# Altium schematic sheet 2-SOM Interface.SchDoc: SOM Interface
size B; CompanyName: NextGen RF Design; Address1: 2130 Howard Drive W; Address2: North Mankato, MN 56003; Address3: www.nextgenrf.com; Revision: 2; SheetNumber: 2; SheetTotal: 7; ProjName: BytePipe X9002_HDK
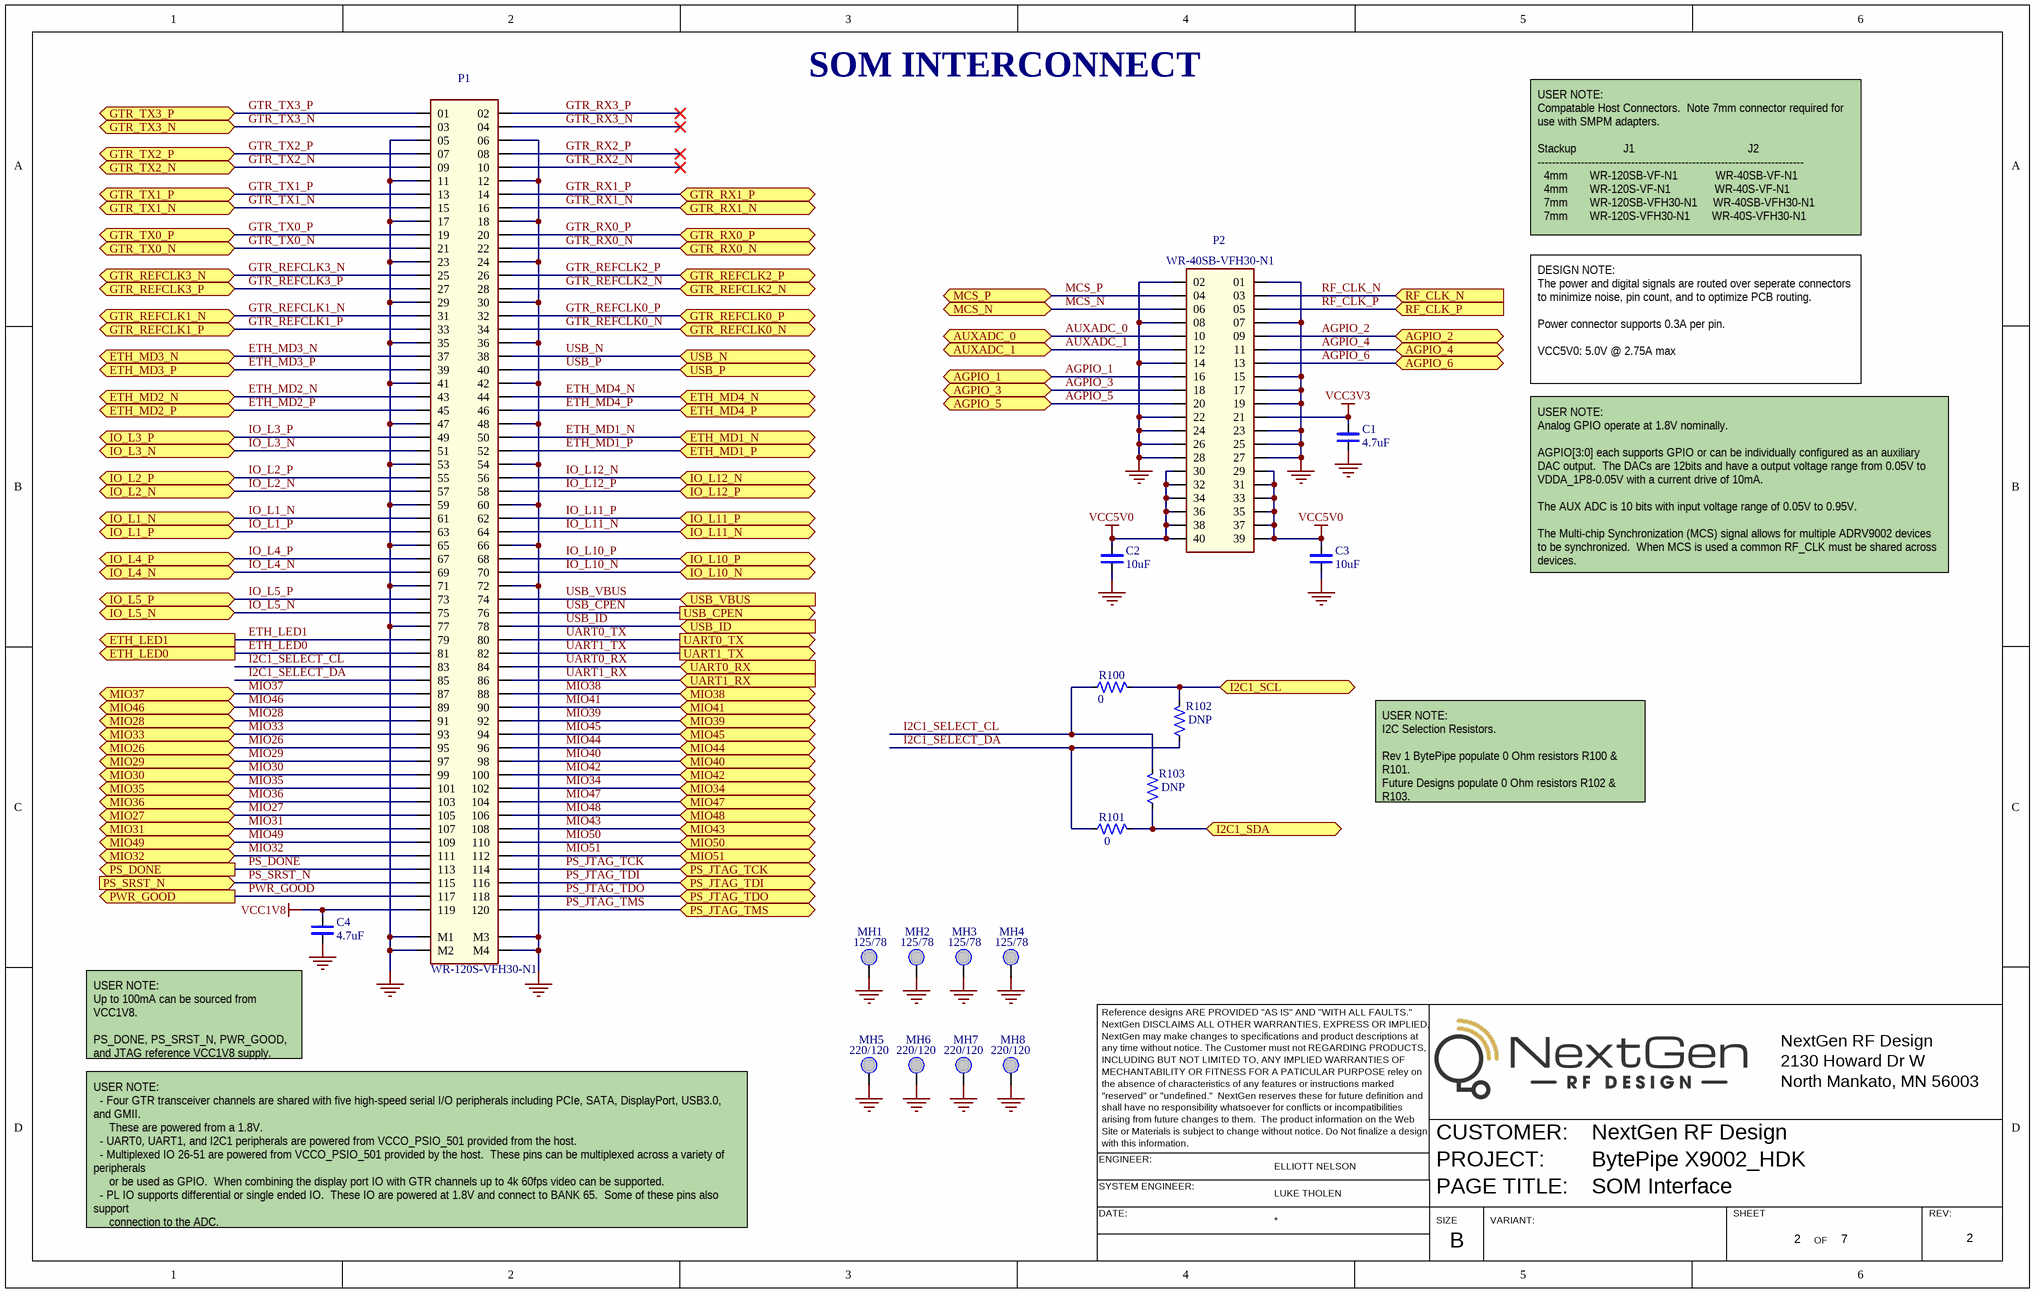
[diagram p0: 2-SOM Interface.SchDoc]

## Parts
C1  value 4.7uF  [SM/0402/CAP]  (hidden comment: CAP_CERAMIC_0402)
C2  value 10uF  [SM/0402/CAP]  (hidden comment: CAP_CERAMIC_0402)
C3  value 10uF  [SM/0402/CAP]  (hidden comment: CAP_CERAMIC_0402)
C4  value 4.7uF  [SM/0402/CAP]  (hidden comment: CAP_CERAMIC_0402)
MH1  HOLE_PTH_125/78  [MTG125/78]  (value not drawn)  (no BOM)
MH2  HOLE_PTH_125/78  [MTG125/78]  (value not drawn)  (no BOM)
MH3  HOLE_PTH_125/78  [MTG125/78]  (value not drawn)  (no BOM)
MH4  HOLE_PTH_125/78  [MTG125/78]  (value not drawn)  (no BOM)
MH5  HOLE_PTH_220/120  [MTG220/120]  (value not drawn)  (no BOM)
MH6  HOLE_PTH_220/120  [MTG220/120]  (value not drawn)  (no BOM)
MH7  HOLE_PTH_220/120  [MTG220/120]  (value not drawn)  (no BOM)
MH8  HOLE_PTH_220/120  [MTG220/120]  (value not drawn)  (no BOM)
P1  value WR-120S-VFH30-N1  [SM/CON/JAE/WR-120S-VFH30-N1]  (hidden comment: WR-120S-VFH30-N1‎)
P2  value WR-40SB-VFH30-N1  [SM/CON/JAE/WR-40SB-VFH30-N1]  (hidden comment: WR-40SB-VFH30-N1‎)
R100  value 0  [SM/0402/RES]  (hidden comment: RES_0402_A)
R101  value 0  [SM/0402/RES]  (hidden comment: RES_0402_A)
R102  value DNP  [SM/0402/RES]  (hidden comment: RES_0402_A)
R103  value DNP  [SM/0402/RES]  (hidden comment: RES_0402_A)

## Ports
AGPIO_1 (bidir), AGPIO_2 (bidir), AGPIO_3 (bidir), AGPIO_4 (bidir), AGPIO_5 (bidir), AGPIO_6 (bidir), AUXADC_0 (bidir), AUXADC_1 (bidir), ETH_LED0 (out), ETH_LED1 (out), ETH_MD1_N (bidir), ETH_MD1_P (bidir), ETH_MD2_N (bidir), ETH_MD2_P (bidir), ETH_MD3_N (bidir), ETH_MD3_P (bidir), ETH_MD4_N (bidir), ETH_MD4_P (bidir), GTR_REFCLK0_N (bidir), GTR_REFCLK0_P (bidir), GTR_REFCLK1_N (bidir), GTR_REFCLK1_P (bidir), GTR_REFCLK2_N (bidir), GTR_REFCLK2_P (bidir), GTR_REFCLK3_N (bidir), GTR_REFCLK3_P (bidir), GTR_RX0_N (bidir), GTR_RX0_P (bidir), GTR_RX1_N (bidir), GTR_RX1_P (bidir), GTR_TX0_N (bidir), GTR_TX0_P (bidir), GTR_TX1_N (bidir), GTR_TX1_P (bidir), GTR_TX2_N (bidir), GTR_TX2_P (bidir), GTR_TX3_N (bidir), GTR_TX3_P (bidir), I2C1_SCL (bidir), I2C1_SDA (bidir), IO_L1_N (bidir), IO_L1_P (bidir), IO_L2_N (bidir), IO_L2_P (bidir), IO_L3_N (bidir), IO_L3_P (bidir), IO_L4_N (bidir), IO_L4_P (bidir), IO_L5_N (bidir), IO_L5_P (bidir), IO_L10_N (bidir), IO_L10_P (bidir), IO_L11_N (bidir), IO_L11_P (bidir), IO_L12_N (bidir), IO_L12_P (bidir), MCS_N (bidir), MCS_P (bidir), MIO26 (bidir), MIO27 (bidir), MIO28 (bidir), MIO29 (bidir), MIO30 (bidir), MIO31 (bidir), MIO32 (bidir), MIO33 (bidir), MIO34 (bidir), MIO35 (bidir), MIO36 (bidir), MIO37 (bidir), MIO38 (bidir), MIO39 (bidir), MIO40 (bidir), MIO41 (bidir), MIO42 (bidir), MIO43 (bidir), MIO44 (bidir), MIO45 (bidir), MIO46 (bidir), MIO47 (bidir), MIO48 (bidir), MIO49 (bidir), MIO50 (bidir), MIO51 (bidir), PS_DONE (out), PS_JTAG_TCK (bidir), PS_JTAG_TDI (bidir), PS_JTAG_TDO (bidir), PS_JTAG_TMS (bidir), PS_SRST_N (in), PWR_GOOD (out), RF_CLK_N (in), RF_CLK_P (in), UART0_RX (in), UART0_TX (out), UART1_RX (in), UART1_TX (out), USB_CPEN (out), USB_ID (in), USB_N (bidir), USB_P (bidir), USB_VBUS (in)

## Nets
GND: C1.2(N2) C2.2(N2) C3.2(N2) C4.2(N2) MH1.1(N1) MH2.1(N1) MH3.1(N1) MH4.1(N1) MH5.1(N1) MH6.1(N1) MH7.1(N1) MH8.1(N1) P1.05 P1.06 P1.11 P1.12 P1.17 P1.18 P1.23 P1.24 P1.29 P1.30 P1.35 P1.36 P1.41 P1.42 P1.47 P1.48 P1.53 P1.54 P1.59 P1.60 P1.65 P1.66 P1.71 P1.72 P1.77 P1.M1 P1.M2 P1.M3 P1.M4 P2.01 P2.02 P2.07 P2.08 P2.14 P2.15 P2.17 P2.19 P2.22 P2.23 P2.24 P2.25 P2.26 P2.27 P2.28
VCC1V8: C4.1(N1) P1.119
VCC3V3: C1.1(N1) P2.21
VCC5V0: C2.1(N1) C3.1(N1) P2.29 P2.30 P2.31 P2.32 P2.33 P2.34 P2.35 P2.36 P2.37 P2.38 P2.39 P2.40
AGPIO_1: P2.16 ; port AGPIO_1
AGPIO_2: P2.09 ; port AGPIO_2
AGPIO_3: P2.18 ; port AGPIO_3
AGPIO_4: P2.11 ; port AGPIO_4
AGPIO_5: P2.20 ; port AGPIO_5
AGPIO_6: P2.13 ; port AGPIO_6
AUXADC_0: P2.10 ; port AUXADC_0
AUXADC_1: P2.12 ; port AUXADC_1
ETH_LED0: P1.81 ; port ETH_LED0
ETH_LED1: P1.79 ; port ETH_LED1
ETH_MD1_N: P1.50 ; port ETH_MD1_N
ETH_MD1_P: P1.52 ; port ETH_MD1_P
ETH_MD2_N: P1.43 ; port ETH_MD2_N
ETH_MD2_P: P1.45 ; port ETH_MD2_P
ETH_MD3_N: P1.37 ; port ETH_MD3_N
ETH_MD3_P: P1.39 ; port ETH_MD3_P
ETH_MD4_N: P1.44 ; port ETH_MD4_N
ETH_MD4_P: P1.46 ; port ETH_MD4_P
GTR_REFCLK0_N: P1.34 ; port GTR_REFCLK0_N
GTR_REFCLK0_P: P1.32 ; port GTR_REFCLK0_P
GTR_REFCLK1_N: P1.31 ; port GTR_REFCLK1_N
GTR_REFCLK1_P: P1.33 ; port GTR_REFCLK1_P
GTR_REFCLK2_N: P1.28 ; port GTR_REFCLK2_N
GTR_REFCLK2_P: P1.26 ; port GTR_REFCLK2_P
GTR_REFCLK3_N: P1.25 ; port GTR_REFCLK3_N
GTR_REFCLK3_P: P1.27 ; port GTR_REFCLK3_P
GTR_RX0_N: P1.22 ; port GTR_RX0_N
GTR_RX0_P: P1.20 ; port GTR_RX0_P
GTR_RX1_N: P1.16 ; port GTR_RX1_N
GTR_RX1_P: P1.14 ; port GTR_RX1_P
GTR_RX2_N: P1.10
GTR_RX2_P: P1.08
GTR_RX3_N: P1.04
GTR_RX3_P: P1.02
GTR_TX0_N: P1.21 ; port GTR_TX0_N
GTR_TX0_P: P1.19 ; port GTR_TX0_P
GTR_TX1_N: P1.15 ; port GTR_TX1_N
GTR_TX1_P: P1.13 ; port GTR_TX1_P
GTR_TX2_N: P1.09 ; port GTR_TX2_N
GTR_TX2_P: P1.07 ; port GTR_TX2_P
GTR_TX3_N: P1.03 ; port GTR_TX3_N
GTR_TX3_P: P1.01 ; port GTR_TX3_P
I2C1_SCL: R100.1 R102.1 ; port I2C1_SCL
I2C1_SDA: R101.1 R103.2 ; port I2C1_SDA
I2C1_SELECT_CL: P1.83 R100.2 R103.1
I2C1_SELECT_DA: P1.85 R101.2 R102.2
IO_L1_N: P1.61 ; port IO_L1_N
IO_L1_P: P1.63 ; port IO_L1_P
IO_L2_N: P1.57 ; port IO_L2_N
IO_L2_P: P1.55 ; port IO_L2_P
IO_L3_N: P1.51 ; port IO_L3_N
IO_L3_P: P1.49 ; port IO_L3_P
IO_L4_N: P1.69 ; port IO_L4_N
IO_L4_P: P1.67 ; port IO_L4_P
IO_L5_N: P1.75 ; port IO_L5_N
IO_L5_P: P1.73 ; port IO_L5_P
IO_L10_N: P1.70 ; port IO_L10_N
IO_L10_P: P1.68 ; port IO_L10_P
IO_L11_N: P1.64 ; port IO_L11_N
IO_L11_P: P1.62 ; port IO_L11_P
IO_L12_N: P1.56 ; port IO_L12_N
IO_L12_P: P1.58 ; port IO_L12_P
MCS_N: P2.06 ; port MCS_N
MCS_P: P2.04 ; port MCS_P
MIO26: P1.95 ; port MIO26
MIO27: P1.105 ; port MIO27
MIO28: P1.91 ; port MIO28
MIO29: P1.97 ; port MIO29
MIO30: P1.99 ; port MIO30
MIO31: P1.107 ; port MIO31
MIO32: P1.111 ; port MIO32
MIO33: P1.93 ; port MIO33
MIO34: P1.102 ; port MIO34
MIO35: P1.101 ; port MIO35
MIO36: P1.103 ; port MIO36
MIO37: P1.87 ; port MIO37
MIO38: P1.88 ; port MIO38
MIO39: P1.92 ; port MIO39
MIO40: P1.98 ; port MIO40
MIO41: P1.90 ; port MIO41
MIO42: P1.100 ; port MIO42
MIO43: P1.108 ; port MIO43
MIO44: P1.96 ; port MIO44
MIO45: P1.94 ; port MIO45
MIO46: P1.89 ; port MIO46
MIO47: P1.104 ; port MIO47
MIO48: P1.106 ; port MIO48
MIO49: P1.109 ; port MIO49
MIO50: P1.110 ; port MIO50
MIO51: P1.112 ; port MIO51
PS_DONE: P1.113 ; port PS_DONE
PS_JTAG_TCK: P1.114 ; port PS_JTAG_TCK
PS_JTAG_TDI: P1.116 ; port PS_JTAG_TDI
PS_JTAG_TDO: P1.118 ; port PS_JTAG_TDO
PS_JTAG_TMS: P1.120 ; port PS_JTAG_TMS
PS_SRST_N: P1.115 ; port PS_SRST_N
PWR_GOOD: P1.117 ; port PWR_GOOD
RF_CLK_N: P2.03 ; port RF_CLK_N
RF_CLK_P: P2.05 ; port RF_CLK_P
UART0_RX: P1.84 ; port UART0_RX
UART0_TX: P1.80 ; port UART0_TX
UART1_RX: P1.86 ; port UART1_RX
UART1_TX: P1.82 ; port UART1_TX
USB_CPEN: P1.76 ; port USB_CPEN
USB_ID: P1.78 ; port USB_ID
USB_N: P1.38 ; port USB_N
USB_P: P1.40 ; port USB_P
USB_VBUS: P1.74 ; port USB_VBUS

## Notes on the sheet
- SOM INTERCONNECT
- USER NOTE:
  Compatable Host Connectors.  Note 7mm connector required for use with SMPM adapters.
  Stackup               J1                                    J2
  --------------------------------------------------------------------------
  4mm       WR-120SB-VF-N1            WR-40SB-VF-N1
  4mm       WR-120S-VF-N1              WR-40S-VF-N1
  7mm       WR-120SB-VFH30-N1     WR-40SB-VFH30-N1
  7mm       WR-120S-VFH30-N1       WR-40S-VFH30-N1
- DESIGN NOTE:
  The power and digital signals are routed over seperate connectors to minimize noise, pin count, and to optimize PCB routing.
  Power connector supports 0.3A per pin.
  VCC5V0: 5.0V @ 2.75A max
- USER NOTE:
  Analog GPIO operate at 1.8V nominally.
  AGPIO[3:0] each supports GPIO or can be individually configured as an auxiliary DAC output.  The DACs are 12bits and have a output voltage range from 0.05V to VDDA_1P8-0.05V with a current drive of 10mA.
  The AUX ADC is 10 bits with input voltage range of 0.05V to 0.95V.
  The Multi-chip Synchronization (MCS) signal allows for multiple ADRV9002 devices to be synchronized.  When MCS is used a common RF_CLK must be shared across devices.
- USER NOTE:
  I2C Selection Resistors.
  Rev 1 BytePipe populate 0 Ohm resistors R100 & R101.
  Future Designs populate 0 Ohm resistors R102 & R103.
- Reference designs ARE PROVIDED "AS IS" AND "WITH ALL FAULTS."
- NextGen DISCLAIMS ALL OTHER WARRANTIES, EXPRESS OR IMPLIED,
- NextGen may make changes to specifications and product descriptions at
- NextGen RF Design
- (near C4) USER NOTE:
  Up to 100mA can be sourced from VCC1V8.
  PS_DONE, PS_SRST_N, PWR_GOOD, and JTAG reference VCC1V8 supply.
- any time without notice. The Customer must not REGARDING PRODUCTS,
- INCLUDING BUT NOT LIMITED TO, ANY IMPLIED WARRANTIES OF
- MECHANTABILITY OR FITNESS FOR A PATICULAR PURPOSE reley on
- "reserved" or "undefined."  NextGen reserves these for future definition and
- the absence of characteristics of any features or instructions marked
- shall have no responsibility whatsoever for conflicts or incompatibilities
- 2130 Howard Dr W
- North Mankato, MN 56003
- ENGINEER:
- Site or Materials is subject to change without notice. Do Not finalize a design
- with this information.
- arising from future changes to them.  The product information on the Web
- ELLIOTT NELSON
- CUSTOMER:
- PROJECT:
- USER NOTE:
  - Four GTR transceiver channels are shared with five high-speed serial I/O peripherals including PCIe, SATA, DisplayPort, USB3.0, and GMII.
  These are powered from a 1.8V.
  - UART0, UART1, and I2C1 peripherals are powered from VCCO_PSIO_501 provided from the host.
  - Multiplexed IO 26-51 are powered from VCCO_PSIO_501 provided by the host.  These pins can be multiplexed across a variety of peripherals
  or be used as GPIO.  When combining the display port IO with GTR channels up to 4k 60fps video can be supported.
  - PL IO supports differential or single ended IO.  These IO are powered at 1.8V and connect to BANK 65.  Some of these pins also support
  connection to the ADC.
  - USB OTG signals support USB2.0 host or device.  They can be combined with GTR channels to support USB 3.0.
- SYSTEM ENGINEER:
- DATE:
- LUKE THOLEN
- SIZE
- PAGE TITLE:
- VARIANT:
- SHEET
- OF
- REV:
- B
- (in symbol HOLE_PTH_125/78) 125/78
- (in symbol HOLE_PTH_220/120) 220/120

## Library data of the parts
C1 C4 = CAP_CERAMIC_0402: CAP CER 4.7UF 10V X5R 0402; TOL: ±20%; OEM#: CL05A475MP5NRNC; OEM NAME: Samsung; VOLT: 10V
C2 C3 = CAP_CERAMIC_0402: 10µF ±20% 10V Ceramic Capacitor X5R 0402 (1005 Metric); OEM#: CL05A106MP8NUB8; OEM NAME: Samsung; TOL: ±20%; VOLT: 10V
MH1-MH4 = HOLE_PTH_125/78: 125 mil pad / 78 mil hole
MH5-MH8 = HOLE_PTH_220/120: 220 mil pad / 120 mil hole (#4 Pan Head Screw)
P1 = CON_JAE_WR-120S-VFH30-N1: 0.5 mm pitch, 120 Position Connector Receptacle, Center Strip Contacts Surface Mount Gold.; OEM NAME: JAE; OEM#: WR-120S-VFH30-N1
P2 = CON_JAE_WR-40SB-VFH30-N1: 0.5 mm pitch, 40 Position Connector Receptacle, Center Strip Contacts Surface Mount Gold, with Alignment Pins.; OEM NAME: JAE; OEM#: WR-40SB-VFH30-N1
R100 R101 = RES_0402_A: RES SMD 0 OHM JUMPER 1/10W 0402; OEM#: ERJ-2GE0R00X; OEM NAME: Panasonic; TOL: 1%
R102 R103 = RES_0402_A: DNP; OEM#: DNP